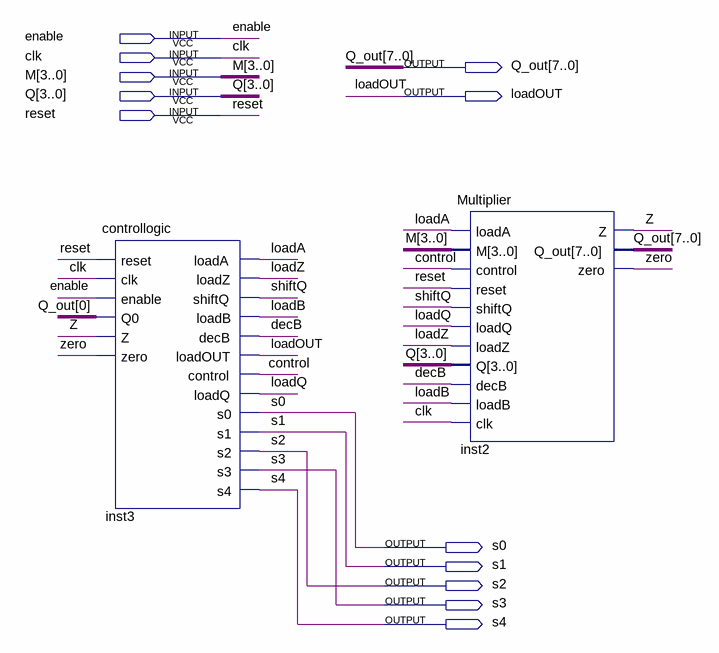
[diagram p0: schematic sheet]
// Quartus schematic Lab2_Multiplier.bdf as structural Verilog: 2 symbols, 12 pins
module Lab2_Multiplier (
  input  enable,
  input  clk,
  input  [3:0] M,
  input  [3:0] Q,
  input  reset,
  output [7:0] Q_out,
  output loadOUT,
  output s0,
  output s1,
  output s2,
  output s3,
  output s4
);

  wire control, decB, loadA, loadB, loadQ, loadZ, shiftQ, Z, zero;

  controllogic inst3 (
    .reset(reset), .clk(clk), .enable(enable), .Q0(Q_out[0]), .Z(Z), .zero(zero), .loadA(loadA),
    .loadZ(loadZ), .shiftQ(shiftQ), .loadB(loadB), .decB(decB), .loadOUT(loadOUT), .control(control),
    .loadQ(loadQ), .s0(s0), .s1(s1), .s2(s2), .s3(s3), .s4(s4));
  Multiplier inst2 (
    .loadA(loadA), .M(M), .control(control), .reset(reset), .shiftQ(shiftQ), .loadQ(loadQ), .loadZ(loadZ),
    .Q(Q), .decB(decB), .loadB(loadB), .clk(clk), .Z(Z), .Q_out(Q_out), .zero(zero));
endmodule
